# EAGLE design Power-PCB (EAGLE 7.7.0)
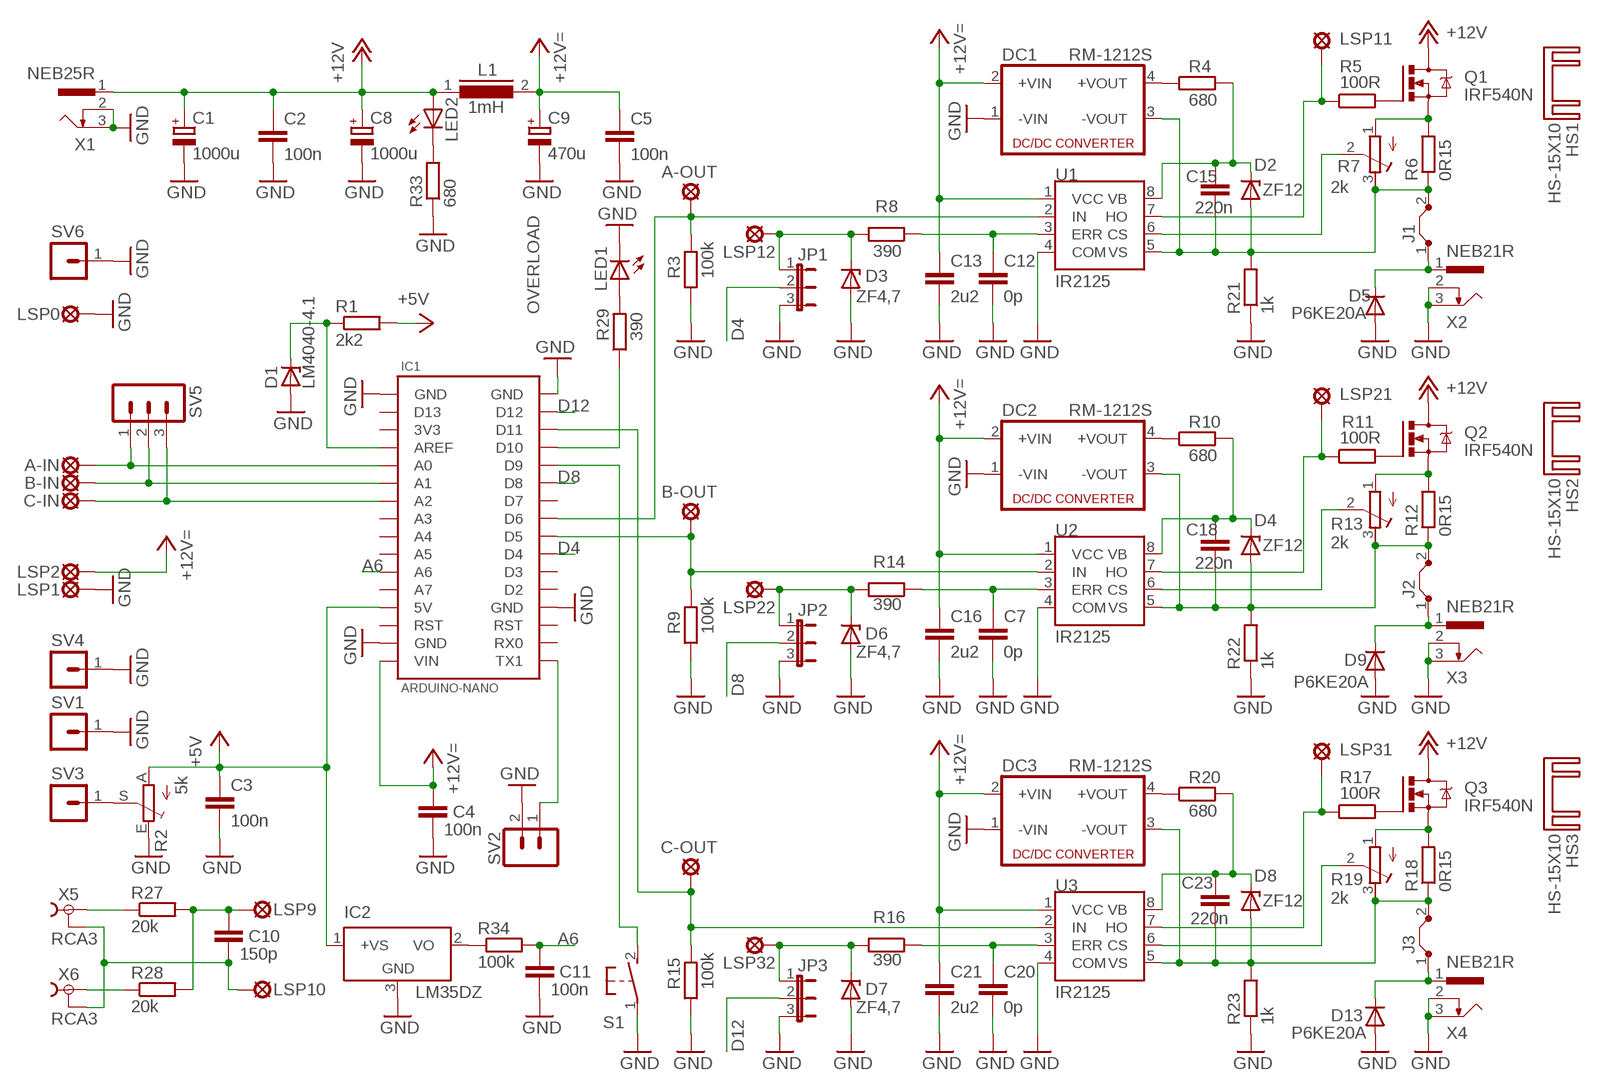
[diagram p0: schematic, sheet 1]

## Parts
A-IN  LSP13  [LSP13]
A-OUT  LSP13  [LSP13]
B-IN  LSP13  [LSP13]
B-OUT  LSP13  [LSP13]
C1  1000u  CPOL-EUE5-13  [E5-13]
C2  100n  C-EU050-024X044  [C050-024X044]
C3  100n  C-EU050-024X044  [C050-024X044]
C4  100n  C-EU050-024X044  [C050-024X044]
C5  100n  C-EU050-024X044  [C050-024X044]
C7  0p  C-EU025-024X044  [C025-024X044]
C8  1000u  CPOL-EUE5-13  [E5-13]
C9  470u  CPOL-EUE5-10.5  [E5-10,5]
C10  150p  C-EU025-024X044  [C025-024X044]
C11  100n  C-EU050-024X044  [C050-024X044]
C12  0p  C-EU025-024X044  [C025-024X044]
C13  2u2  C-EUC1206  [C1206]
C15  220n  C-EU050-024X044  [C050-024X044]
C16  2u2  C-EUC1206  [C1206]
C18  220n  C-EU050-024X044  [C050-024X044]
C20  0p  C-EU025-024X044  [C025-024X044]
C21  2u2  C-EUC1206  [C1206]
C23  220n  C-EU050-024X044  [C050-024X044]
C-IN  LSP13  [LSP13]
C-OUT  LSP13  [LSP13]
D1  LM4040-4.1  LM4040  [TO-92]
D2  ZF12  BZX90  [DO34Z7]
D3  ZF4,7  BZX90  [DO34Z7]
D4  ZF12  BZX90  [DO34Z7]
D5  P6KE20A  DIODE-C1702-05  [C1702-05]
D6  ZF4,7  BZX90  [DO34Z7]
D7  ZF4,7  BZX90  [DO34Z7]
D8  ZF12  BZX90  [DO34Z7]
D9  P6KE20A  DIODE-C1702-05  [C1702-05]
D13  P6KE20A  DIODE-C1702-05  [C1702-05]
DC1  RM-1212S  NME  [NME]
DC2  RM-1212S  NME  [NME]
DC3  RM-1212S  NME  [NME]
HS1  HS-15X10  [HEATSINK-TO220-15X10X21]
HS2  HS-15X10  [HEATSINK-TO220-15X10X21]
HS3  HS-15X10  [HEATSINK-TO220-15X10X21]
IC1  ARDUINO-NANO  [ARDUINO-NANO]
IC2  LM35DZ  LM35CZ  [TO92]
J1  JUMPER-BRIGDE12MM  [12-THICK-WIRE]
J2  JUMPER-BRIGDE12MM  [12-THICK-WIRE]
J3  JUMPER-BRIGDE12MM  [12-THICK-WIRE]
JP1  JP2E  [JP2]
JP2  JP2E  [JP2]
JP3  JP2E  [JP2]
L1  1mH  L-09HCP  [L-09HCP]
LED1  LED5MM  [LED5MM]
LED2  LED3MM  [LED3MM]
LSP0  LSP13  [LSP13]
LSP1  LSP13  [LSP13]
LSP2  LSP13  [LSP13]
LSP9  LSP13  [LSP13]
LSP10  LSP13  [LSP13]
LSP11  LSP11  [LSP11]
LSP12  LSP11  [LSP11]
LSP21  LSP11  [LSP11]
LSP22  LSP11  [LSP11]
LSP31  LSP11  [LSP11]
LSP32  LSP11  [LSP11]
Q1  IRF540N  IRF540  [TO220BV]
Q2  IRF540N  IRF540  [TO220BV]
Q3  IRF540N  IRF540  [TO220BV]
R1  2k2  R-EU_M1206  [M1206]
R2  5k  TRIM_EU-PT10  [PT-10]
R3  100k  R-EU_0207/10  [0207/10]
R4  680  R-EU_0207/10  [0207/10]
R5  100R  R-EU_M1206  [M1206]
R6  0R15  R-EU_0617/5V  [0617V]
R7  2k  R-TRIMM64W  [RTRIM64W]
R8  390  R-EU_M1206  [M1206]
R9  100k  R-EU_0207/10  [0207/10]
R10  680  R-EU_0207/10  [0207/10]
R11  100R  R-EU_M1206  [M1206]
R12  0R15  R-EU_0617/5V  [0617V]
R13  2k  R-TRIMM64W  [RTRIM64W]
R14  390  R-EU_M1206  [M1206]
R15  100k  R-EU_0207/10  [0207/10]
R16  390  R-EU_M1206  [M1206]
R17  100R  R-EU_M1206  [M1206]
R18  0R15  R-EU_0617/5V  [0617V]
R19  2k  R-TRIMM64W  [RTRIM64W]
R20  680  R-EU_0207/10  [0207/10]
R21  1k  R-EU_0207/2V  [0207/2V]
R22  1k  R-EU_0207/2V  [0207/2V]
R23  1k  R-EU_0207/2V  [0207/2V]
R27  20k  R-EU_M1206  [M1206]
R28  20k  R-EU_M1206  [M1206]
R29  390  R-EU_0207/10  [0207/10]
R33  680  R-EU_M1206  [M1206]
R34  100k  R-EU_M1206  [M1206]
S1  31-XX  [B3F-31XX]
SV1  MA01-1  [MA01-1]
SV2  MA02-1  [MA02-1]
SV3  MA01-1  [MA01-1]
SV4  MA01-1  [MA01-1]
SV5  MA03-1  [MA03-1]
SV6  MA01-1  [MA01-1]
U1  IR2125  [DIL08]
U2  IR2125  [DIL08]
U3  IR2125  [DIL08]
X1  NEB25R  NEB21R  [NEB21R]
X2  NEB21R  [NEB21R]
X3  NEB21R  [NEB21R]
X4  NEB21R  [NEB21R]
X5  RCA3  [RCA3]
X6  RCA3  [RCA3]

## Nets
+5V: C3.1 IC1.+5V(5V) IC2.1(+VS) R1.2 R2.A
+12V [Stromversorgung]: C1.+ C2.1 C8.+ L1.1 LED2.A Q1.D Q2.D Q3.D X1.1
+12V= [Stromversorgung]: C4.1 C5.1 C9.+ C13.1 C16.1 C21.1 DC1.2(+VIN) DC2.2(+VIN) DC3.2(+VIN) IC1.VIN L1.2 LSP2.MP U1.1(VCC) U2.1(VCC) U3.1(VCC)
A6: C11.1 IC1.A6 R34.2
AREF: D1.2(C) IC1.AREF R1.1
D4: IC1.D4 JP1.2
D5: B-OUT.MP IC1.D5 R9.2 U2.2(IN)
D6: A-OUT.MP IC1.D6 R3.2 U1.2(IN)
D8: IC1.D8 JP2.2
D11: C-OUT.MP IC1.D11 R15.2 U3.2(IN)
D12: IC1.D12 JP3.2
GND [Stromversorgung]: C1.- C2.2 C3.2 C4.2 C5.2 C7.2 C8.- C9.- C11.2 C12.2 C13.2 C16.2 C20.2 C21.2 D1.3(A) D3.A D5.A D6.A D7.A D9.A D13.A DC1.1(-VIN) DC2.1(-VIN) DC3.1(-VIN) IC1.GND IC1.GND1(GND) IC1.GND2(GND) IC1.GND3(GND) IC2.3(GND) JP1.3 JP2.3 JP3.3 LED1.K(C) LSP0.MP LSP1.MP R2.E R3.1 R9.1 R15.1 R21.1 R22.1 R23.1 R33.1 S1.1(P) SV1.1 SV2.2 SV4.1 SV6.1 U1.4(COM) U2.4(COM) U3.4(COM) X1.2 X1.3 X2.2 X2.3 X3.2 X3.3 X4.2 X4.3
N$1: LED1.A R29.2
N$2: A-IN.MP IC1.A0 SV5.1
N$3: B-IN.MP IC1.A1 SV5.2
N$4: C-IN.MP IC1.A2 SV5.3
N$5: C12.1 R8.1 U1.3(ERR)
N$6: IC1.TX1 SV2.1
N$7: IC2.2(VO) R34.1
N$8: DC1.4(+VOUT) R4.1
N$9: D5.C J1.1 X2.1
N$10: C7.1 R14.1 U2.3(ERR)
N$11: DC2.4(+VOUT) R10.1
N$12: R7.2(S) U1.6(CS)
N$13: C20.1 R16.1 U3.3(ERR)
N$14: LED2.K(C) R33.2
N$15: DC3.4(+VOUT) R20.1
N$16: Q1.G R5.2
N$17: Q1.S R6.2 R7.1(A)
N$18: Q2.S R12.2 R13.1(A)
N$19: Q3.S R18.2 R19.1(A)
N$20: LSP11.MP R5.1 U1.7(HO)
N$21: D6.C JP2.1 LSP22.MP R14.2
N$22: Q2.G R11.2
N$23: LSP21.MP R11.1 U2.7(HO)
N$24: R13.2(S) U2.6(CS)
N$25: D9.C J2.1 X3.1
N$26: R2.S SV3.1
N$27: Q3.G R17.2
N$28: LSP31.MP R17.1 U3.7(HO)
N$29: R19.2(S) U3.6(CS)
N$30: D13.C J3.1 X4.1
N$31: D3.C JP1.1 LSP12.MP R8.2
N$32: D7.C JP3.1 LSP32.MP R16.2
N$35: R27.1 X5.1
N$36: R28.1 X6.1
N$37 [Stromversorgung]: C10.2 LSP10.MP X5.2 X5.2@1 X5.2@2 X6.2 X6.2@1 X6.2@2
N$38 [Stromversorgung]: C10.1 LSP9.MP R27.2 R28.2
N$39: IC1.D9 S1.2(S)
OVERLOAD: IC1.D10 R29.1
VBU1: C15.1 D2.C R4.2 U1.8(VB)
VBU2: C18.1 D4.C R10.2 U2.8(VB)
VBU3: C23.1 D8.C R20.2 U3.8(VB)
VSU1: C15.2 D2.A DC1.3(-VOUT) J1.2 R6.1 R7.3(E) R21.2 U1.5(VS)
VSU2: C18.2 D4.A DC2.3(-VOUT) J2.2 R12.1 R13.3(E) R22.2 U2.5(VS)
VSU3: C23.2 D8.A DC3.3(-VOUT) J3.2 R18.1 R19.3(E) R23.2 U3.5(VS)
Unconnected: IC1.A3 IC1.A4 IC1.A5 IC1.A7 IC1.D2 IC1.D3 IC1.D7 IC1.D13 IC1.RESET1(RST) IC1.RESET(RST) IC1.RX0

## Power pins joined to a net without a drawn wire
3V3: IC1.3V3

## Library data of the parts
A-IN A-OUT B-IN B-OUT C-IN C-OUT LSP0 LSP1 LSP2 LSP9 LSP10 = solpad:LSP13: SOLDER PAD drill 1.3 mm, distributor Buerklin, 12H562
C1 C8 C9 = rcl:CPOL-EU: POLARIZED CAPACITOR, European symbol
C2-C5 C7 C10-C13 C15 C16 C18 C20 C21 C23 = rcl:C-EU: CAPACITOR, European symbol
D1 = tj-library:LM4040: Voltage Reference
D2-D4 D6-D8 = diode:BZX90: Z DIODE
D5 D9 D13 = diode:DIODE-: DIODE
DC1-DC3 = dc-dc-converter:NME: DC-DC CONVERTER; MF: C & D TECHNOLOGIES, INC; MPN: NME1205D; OC_FARNELL: 1021466; OC_NEWARK: 98B8198
HS1-HS3 = tj-library:HS-15X10: Heat Sink TO-220 (China, B:15mm x T:10mm x H:21mm)
IC1 = tj-library:ARDUINO-NANO: Arduino Nano
IC2 = lm35:LM35: Single-Supply Centigrade Temperature Sensor Vout = (10mV/°C x Temp °C) +5mmmV Source: http://www.national.com/ds/LM/LM35.pdf
J1-J3 = tj-library:JUMPER-BRIGDE: Bridge for thick wire (up to 1.35mm)
JP1-JP3 = jumper:JP2E: JUMPER
L1 = tj-library:L-09HCP: Fastron Inductor Series 09HCP
LED1 LED2 = led:LED: LED OSRAM: - CHIPLED LG R971, LG N971, LY N971, LG Q971, LY Q971, LO R971, LY R971 LH N974, LH R974 LS Q976, LO Q976, LY Q976 LO Q996 - Hyper CHIPLED LW Q18S LB Q993, LB Q99A, LB R99A - SideLED LS A670, LO A670, LY A670, LG A670, LP A670 LB A673, LV A673, LT A673, LW A673 LH A674 LY A675 LS A676, LA A676, LO A676, LY A676, LW A676 LS A679, LY A679, LG A679 - Hyper Micro SIDELED® LS Y876, LA Y876, LO Y876, LY Y876 LT Y87S - SmartLED LW L88C, LW L88S LB L89C, LB L89S, LG L890 LS L89K, LO L89K, LY L89K LS L896, LA L896, LO L896, LY L896 - TOPLED LS T670, LO T670, LY T670, LG T670, LP T670 LSG T670, LSP T670, LSY T670, LOP T670, LYG T670 LG T671, LOG T671, LSG T671 LB T673, LV T673, LT T673, LW T673 LH T674 LS T676, LA T676, LO T676, LY T676, LB T676, LH T676, LSB T676, LW T676 LB T67C, LV T67C, LT T67C, LS T67K, LO T67K, LY T67K, LW E67C LS E67B, LA E67B, LO E67B, LY E67B, LB E67C, LV E67C, LT E67C LW T67C LS T679, LY T679, LG T679 LS T770, LO T770, LY T770, LG T770, LP T770 LB T773, LV T773, LT T773, LW T773 LH T774 LS E675, LA E675, LY E675, LS T675 LS T776, LA T776, LO T776, LY T776, LB T776 LHGB T686 LT T68C, LB T68C - Hyper Mini TOPLED® LB M676 - Mini TOPLED Santana® LG M470 LS M47K, LO M47K, LY M47K Source: http://www.osram.convergy.de LUXEON: - LUMILED® LXK2-PW12-R00, LXK2-PW12-S00, LXK2-PW14-U00, LXK2-PW14-V00 LXK2-PM12-R00, LXK2-PM12-S00, LXK2-PM14-U00 LXK2-PE12-Q00, LXK2-PE12-R00, LXK2-PE12-S00, LXK2-PE14-T00, LXK2-PE14-U00 LXK2-PB12-K00, LXK2-PB12-L00, LXK2-PB12-M00, LXK2-PB14-N00, LXK2-PB14-P00, LXK2-PB14-Q00 LXK2-PR12-L00, LXK2-PR12-M00, LXK2-PR14-Q00, LXK2-PR14-R00 LXK2-PD12-Q00, LXK2-PD12-R00, LXK2-PD12-S00 LXK2-PH12-R00, LXK2-PH12-S00 LXK2-PL12-P00, LXK2-PL12-Q00, LXK2-PL12-R00 Source: www.luxeon.com KINGBRIGHT: KA-3528ASYC Source: www.kingbright.com
LSP11 LSP12 LSP21 LSP22 LSP31 LSP32 = solpad:LSP11: SOLDER PAD drill 1.1 mm
Q1-Q3 = transistor-power:IRF540: HEXFET Power MOSFET
R1 R3-R6 R8-R12 R14-R18 R20-R23 R27-R29 R33 R34 = rcl:R-EU_: RESISTOR, European symbol
R2 = pot:TRIM_EU-: POTENTIOMETER
R7 R13 R19 = rcl:R-TRIMM: Trimm resistor
S1 = switch-omron:31-XX: OMRON SWITCH; MPN: B3F-3100; OC_FARNELL: 959704; OC_NEWARK: 36M3582
SV1 SV3 SV4 SV6 = tj-library:MA01-1: PIN HEADER
SV2 = tj-library:MA02-1: PIN HEADER
SV5 = con-lstb:MA03-1: PIN HEADER; OC_FARNELL: unknown; OC_NEWARK: unknown
U1-U3 = ir21xx:IR2125: Current limiting high side driver
X1-X4 = con-lumberg:NEB21R: Netzgeräte-Einbaukupplung abgewinkelte Ausführung mit Öffner Source: http://www.lumberg.com/Produkte/PDFs/NEB21R.pdf; MPN: NEB 21 R; OC_FARNELL: 1217037; OC_NEWARK: 97K6458
X5 X6 = tj-library:RCA3: Female Cinch CONNECTOR ( RCA Jack )

## Net classes
0 default: width 0.406 mm, clearance 0.356 mm
1 Stromversorgung: width 0.61 mm, clearance 0.61 mm

## Board
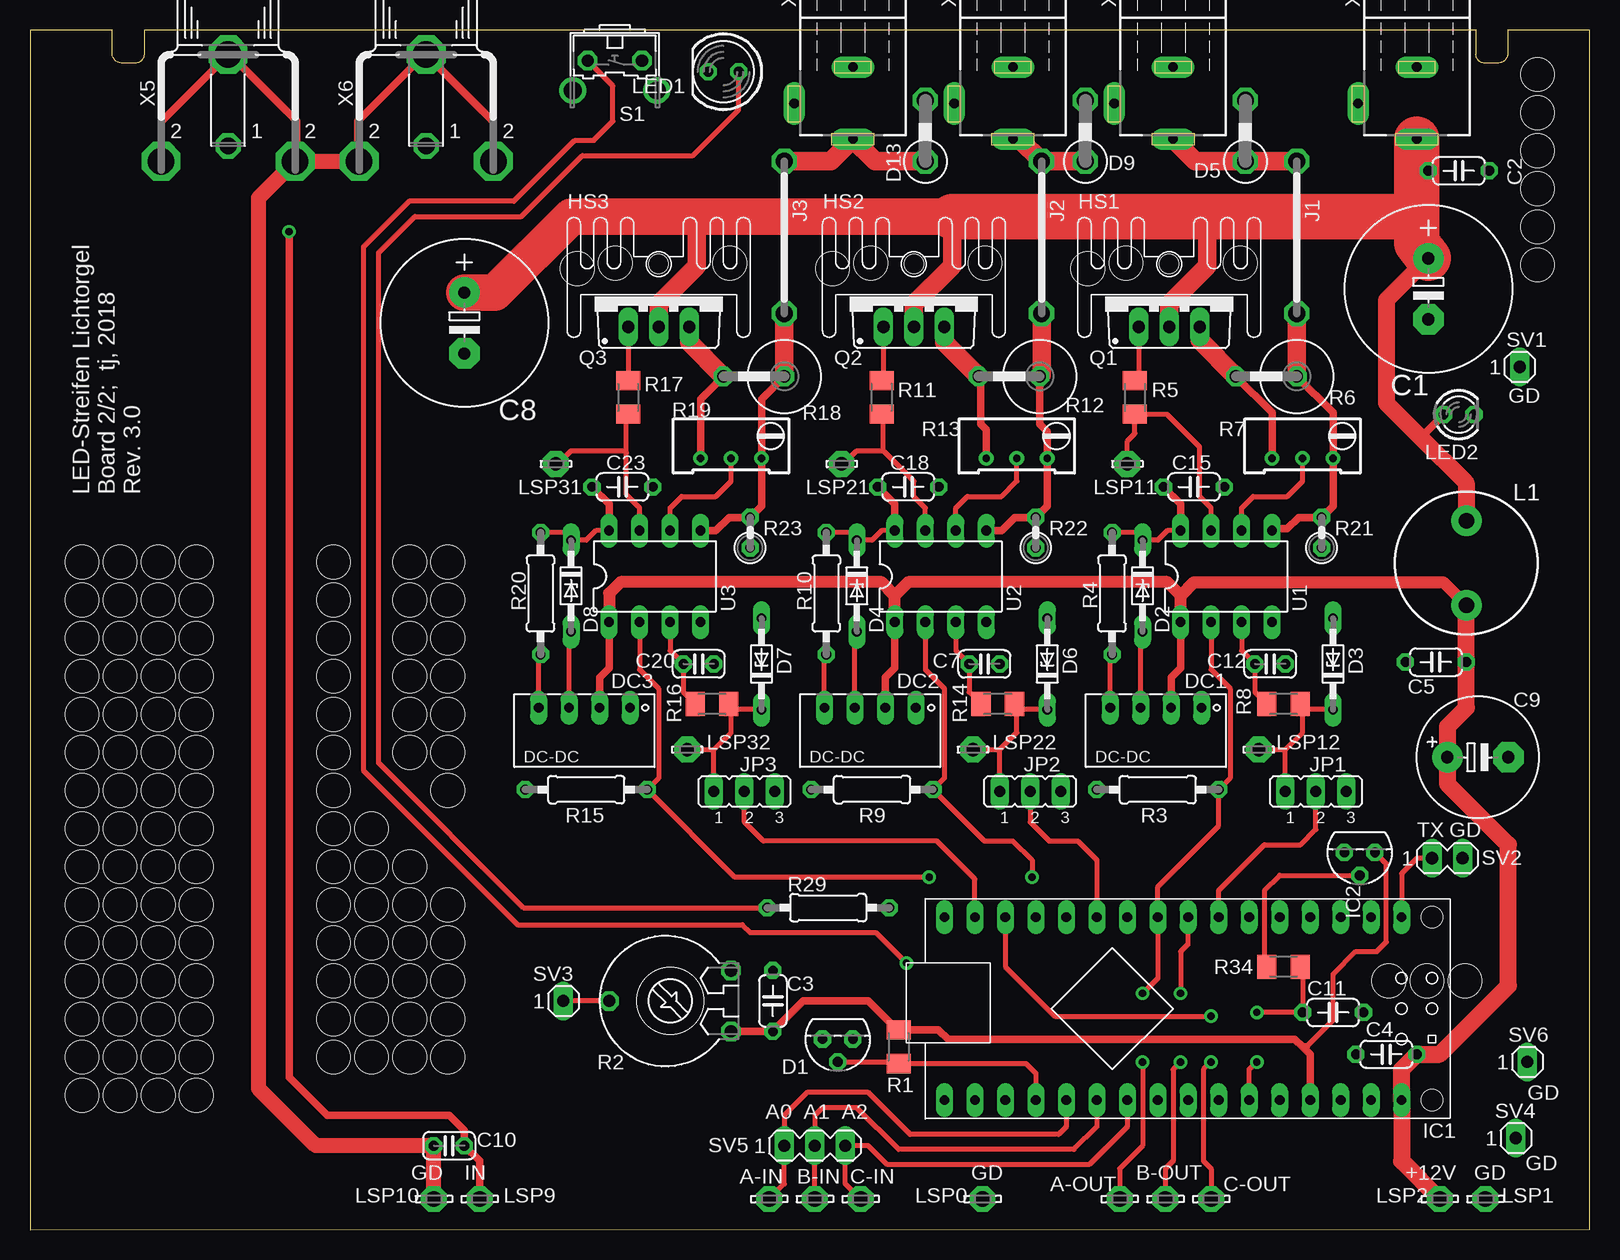
[diagram p1: board, top side]
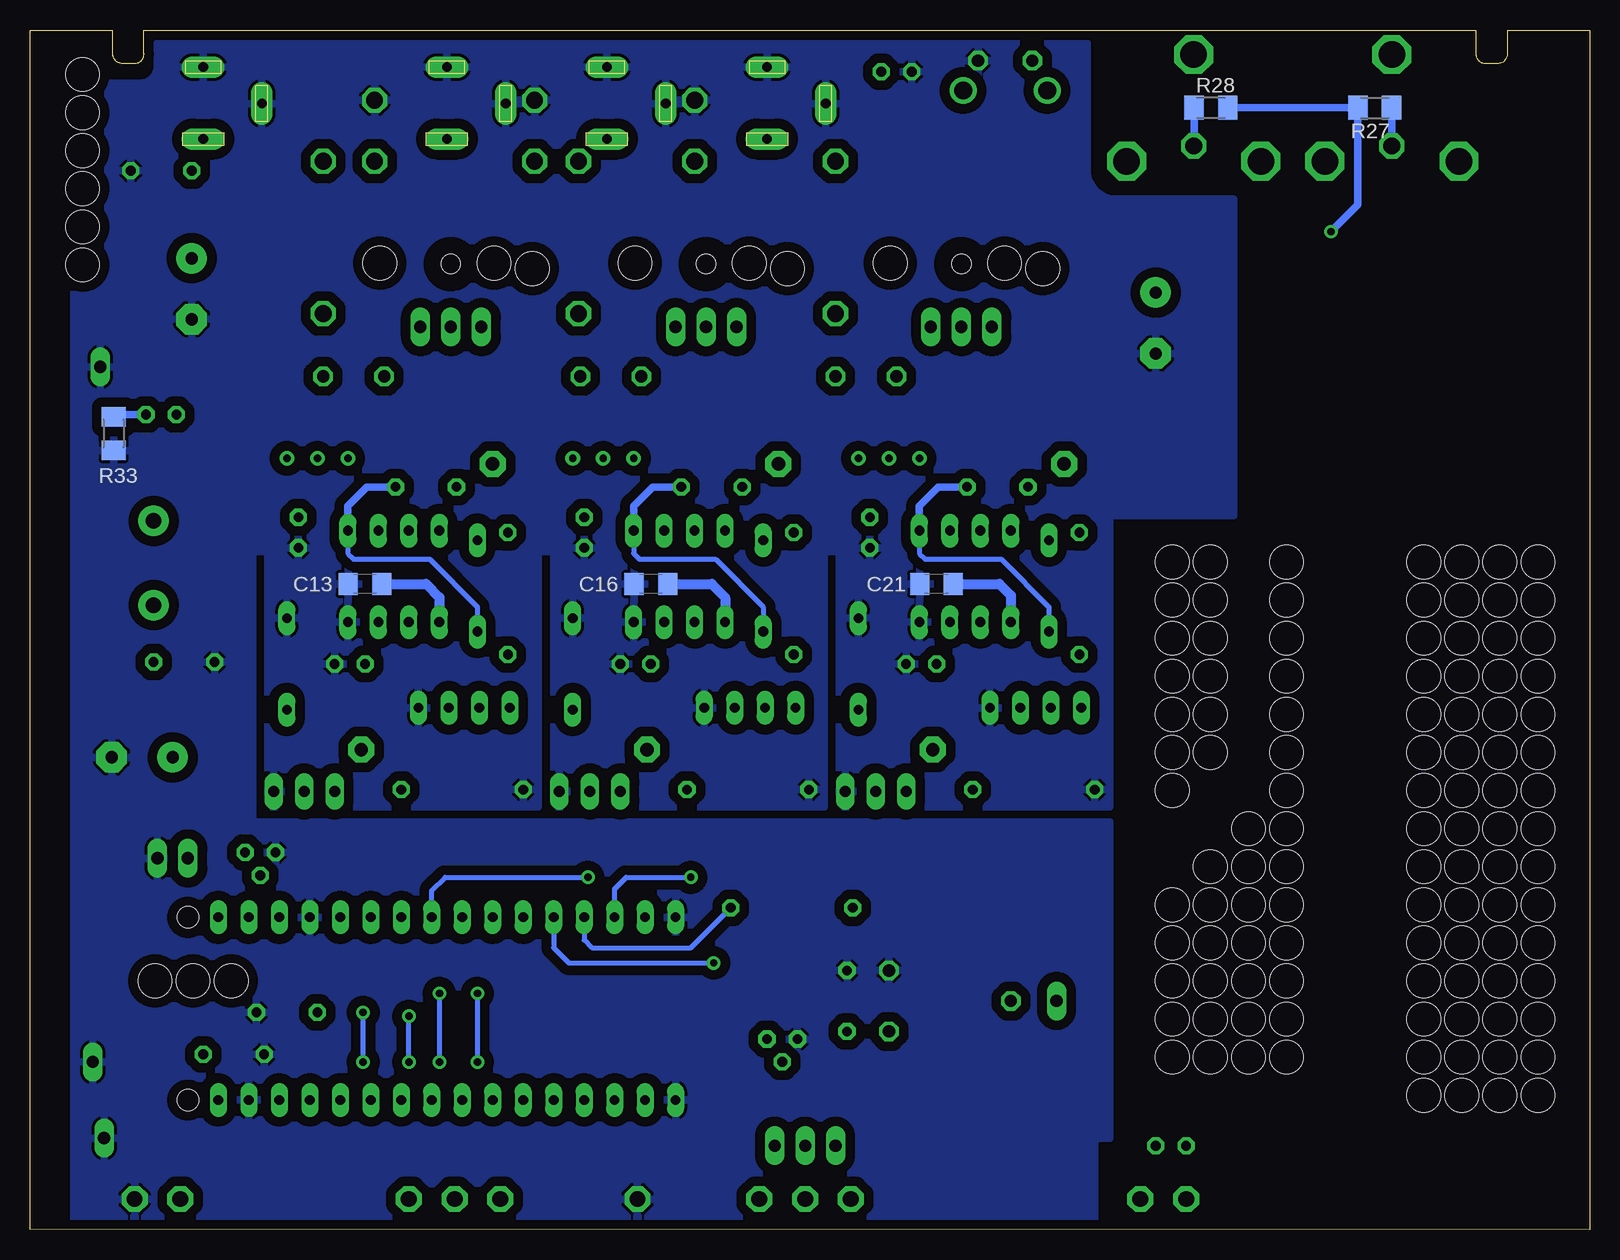
[diagram p2: board, bottom side, seen from below]

Size 130 x 100 mm. Coordinates in mm from the lower left corner, seen from the top.
Outline: 0,0 130,0.03 130,100 123.14,100 123.14,98.13 arc-90 122.4,97.24 121.14,97.24 arc-90 120.5,98.04 120.5,100 9.5,100 9.5,98.04 arc-90 8.86,97.24 7.59,97.24 arc-90 6.84,98.15 6.84,100 0,100 0,0
Copper layers (1*16): Top 0.035mm / dielectric 1.5mm / Bottom 0.035mm
Design rules "default *": minimum track width 10mil, minimum drill 24mil, track to track 8mil, track to pad 8mil, pad to pad 8mil, via to via 8mil, smd to smd 8mil, copper to edge 16mil, drill to drill 8mil, minimum pad ring 12mil, minimum via ring 10mil, stop-mask expansion 4mil, vias tented up to drill 0mil, thermal gap 10mil
Holes 2.8 mm at 58.31,80.57 48.78,80.57 45.61,80.09 66.88,80.09 70.06,80.57 91.33,80.57 79.58,80.57 88.15,80.09 100.85,80.57 34.81,55.65 34.81,52.47 34.81,49.3 34.81,46.12 34.81,42.95 34.81,39.77 34.81,36.6 31.64,55.65 31.64,52.47 31.64,49.3 31.64,46.12 31.64,42.95 31.64,39.77 116.41,20.72 119.58,20.72 34.81,27.07 34.81,23.9 34.81,20.72 34.81,17.55 34.81,14.37 31.64,14.37 31.64,17.55 31.64,20.72 31.64,23.9 31.64,27.07 28.46,14.37 28.46,17.55 28.46,20.72 28.46,23.9 28.46,27.07 28.46,30.25 31.64,30.25 28.46,33.42 7.51,55.65 7.51,52.47 7.51,49.3 7.51,46.12 7.51,42.95 7.51,39.77 7.51,36.6 4.33,55.65 4.33,52.47 4.33,49.3 4.33,46.12 4.33,42.95 4.33,39.77 4.33,36.6 7.51,33.42 7.51,30.25 7.51,27.07 7.51,23.9 7.51,20.72 7.51,17.55 7.51,14.37 4.33,33.42 4.33,30.25 4.33,27.07 4.33,23.9 4.33,20.72 4.33,17.55 4.33,14.37 7.51,11.2 4.33,11.2 10.68,55.65 10.68,52.47 10.68,49.3 10.68,46.12 10.68,42.95 10.68,39.77 10.68,36.6 10.68,33.42 10.68,30.25 10.68,27.07 10.68,23.9 10.68,20.72 10.68,17.55 10.68,14.37 10.68,11.2 25.29,14.37 25.29,17.55 25.29,20.72 25.29,23.9 25.29,27.07 25.29,30.25 25.29,33.42 25.29,36.6 113.23,20.72 125.62,96.29 125.62,93.11 13.86,55.65 13.86,52.47 13.86,49.3 13.86,46.12 13.86,42.95 13.86,39.77 13.86,36.6 13.86,33.42 13.86,30.25 13.86,27.07 13.86,23.9 13.86,20.72 13.86,17.55 13.86,14.37 13.86,11.2 25.29,55.65 25.29,52.47 25.29,49.3 25.29,46.12 25.29,42.95 25.29,39.77 125.62,89.94 125.62,86.76 125.62,83.59 125.62,80.41

### Footprints (pad centres in the part's own frame; a part is rotated, then mirrored left to right if it is on the bottom)
LSP13 = drill 1.321 pad 2.159 octagon: MP 0,0
E5-13 = drill 1.016 pad 2.54: + -2.54,0 | drill 1.016 pad 2.54 octagon: - 2.54,0
C050-024X044 = drill 0.813 octagon: 1 -2.54,0; 2 2.54,0
C025-024X044 = drill 0.813 octagon: 1 -1.27,0; 2 1.27,0
E5-10,5 = drill 1.016 pad 2.54: + -2.54,0 | drill 1.016 pad 2.54 octagon: - 2.54,0
C1206 = smd 1.6 x 1.8: 1 -1.4,0; 2 1.4,0
TO-92 = drill 0.813 octagon: 1 -1.27,0; 2 0,1.905; 3 1.27,0
DO34Z7 = drill 0.813 long: A 3.81,0; C -3.81,0
C1702-05 = drill 1.397 octagon: A 2.54,0; C -2.54,0
NME = drill 0.813 long: 1 0,3.81; 2 0,1.27; 3 0,-1.27; 4 0,-3.81
HEATSINK-TO220-15X10X21 = hole 1.6: 0,1.111
ARDUINO-NANO = drill 0.813 long: 3V3 -15.24,-7.62; +5V 10.16,-7.62; A0 -10.16,-7.62; A1 -7.62,-7.62; A2 -5.08,-7.62; A3 -2.54,-7.62; A4 0,-7.62; A5 2.54,-7.62; A6 5.08,-7.62; A7 7.62,-7.62; AREF -12.7,-7.62; D2 7.62,7.62; D3 5.08,7.62; D4 2.54,7.62; D5 0,7.62; D6 -2.54,7.62; D7 -5.08,7.62; D8 -7.62,7.62; D9 -10.16,7.62; D10 -12.7,7.62; D11 -15.24,7.62; D12 -17.78,7.62; D13 -17.78,-7.62; GND 10.16,7.62; GND1 15.24,-7.62; GND2 -20.32,7.62; GND3 -20.32,-7.62; RESET 12.7,7.62; RESET1 12.7,-7.62; RX0 15.24,7.62; TX1 17.78,7.62; VIN 17.78,-7.62 | hole 1.778: 20.32,7.62; 20.32,-7.62
TO92 = drill 0.813 octagon: 1 -1.27,0; 2 0,1.905; 3 1.27,0
12-THICK-WIRE = drill 1.4 octagon: 1 -6.35,0; 2 6.35,0
JP2 = drill 0.914 long: 1 -2.54,0; 2 0,0; 3 2.54,0
L-09HCP = drill 1.3 pad 2.54: 1 -3.516,0; 2 3.516,0
LED5MM = drill 0.813 octagon: A -1.27,0; K 1.27,0
LED3MM = drill 0.813 octagon: A -1.27,0; K 1.27,0
LSP11 = drill 1.118 pad 2.159 octagon: MP 0,0
TO220BV = drill 1.016 long: D 0,-2.54; G -2.54,-2.54; S 2.54,-2.54
M1206 = smd 1.6 x 2: 1 -1.4,0; 2 1.4,0
PT-10 = drill 1.016 octagon: A -2.54,-5.08; E 2.54,-5.08; S 0,5.08
0207/10 = drill 0.813 octagon: 1 -5.08,0; 2 5.08,0
0617V = drill 1.016 octagon: 1 -2.54,0; 2 2.54,0
RTRIM64W = drill 0.61: 1 1.27,-2.54; 2 1.27,0; 3 1.27,2.54
0207/2V = drill 0.813 octagon: 1 -1.27,0; 2 1.27,0
B3F-31XX = drill 1.016 octagon: 1 -2.261,-1.245; 2 2.261,-1.245 | drill 1.499 pad 2.159: 3 -3.505,1.245; 4 3.505,1.245
MA01-1 = drill 1.016 long: 1 0,0
MA02-1 = drill 1.016 long: 1 -1.27,0; 2 1.27,0
MA03-1 = drill 1.016 long: 1 -2.54,0; 2 0,0; 3 2.54,0
DIL08 = drill 0.813 long: 1 -3.81,-3.81; 2 -1.27,-3.81; 3 1.27,-3.81; 4 3.81,-3.81; 5 3.81,3.81; 6 1.27,3.81; 7 -1.27,3.81; 8 -3.81,3.81
NEB21R = drill 0.813 pad 1.778 long: 1 0,7.35; 2 4.9,4.4; 3 0,1.35
RCA3 = drill 1.397 octagon: 1 0,-2.54 | drill 2.21 octagon: 2 5.588,-3.81; 2@1 -5.588,-3.81; 2@2 0,5.08

### Placement (x,y rotation side)
A-IN  61.59,2.54 0 top
A-OUT  90.81,2.54 0 top
B-IN  65.41,2.54 0 top
B-OUT  94.61,2.54 0 top
C1  116.52,78.42 270 top
C2  119.06,88.27 0 top
C3  61.91,19.05 90 top
C4  113.03,14.61 180 top
C5  117.16,47.31 180 top
C7  79.53,47.15 0 top
C8  36.2,75.56 270 top
C9  120.65,39.37 0 top
C10  34.92,6.99 180 top
C11  108.58,18.1 0 top
C12  103.35,47.15 0 top
C13  102.08,53.82 180 bottom
C15  97,61.91 0 top
C16  78.26,53.82 180 bottom
C18  73.18,61.91 0 top
C20  55.72,47.15 0 top
C21  54.45,53.82 180 bottom
C23  49.37,61.91 0 top
C-IN  69.22,2.54 0 top
C-OUT  98.42,2.54 0 top
D1  67.31,15.88 180 top
D2  92.71,53.66 270 top
D3  108.58,47.15 90 top
D4  68.9,53.66 270 top
D5  101.28,91.6 90 top
D6  84.77,47.15 90 top
D7  60.96,47.15 90 top
D8  45.09,53.66 270 top
D9  87.95,91.6 90 top
D13  74.61,91.6 90 top
DC1  93.82,43.5 270 top
DC2  70.01,43.5 270 top
DC3  46.2,43.5 270 top
HS1  94.93,79.38 0 top
HS2  73.66,79.38 0 top
HS3  52.39,79.38 0 top
IC1  96.52,18.41 0 top
IC2  110.81,31.43 180 top
J1  105.57,82.71 270 top
J2  84.3,82.71 270 top
J3  62.87,82.71 270 top
JP1  107.16,36.51 0 top
JP2  83.34,36.51 0 top
JP3  59.53,36.51 0 top
L1  119.7,55.56 270 top
LED1  57.78,96.52 180 top
LED2  119.06,67.94 0 top
LSP0  79.38,2.54 0 top
LSP1  121.28,2.54 0 top
LSP2  117.47,2.54 0 top
LSP9  37.47,2.54 0 top
LSP10  33.66,2.54 0 top
LSP11  91.44,63.82 0 top
LSP12  102.39,40.01 0 top
LSP21  67.63,63.82 0 top
LSP22  78.58,40.01 0 top
LSP31  43.81,63.82 0 top
LSP32  54.77,40.01 0 top
Q1  94.93,77.79 0 top
Q2  73.66,77.79 0 top
Q3  52.39,77.79 0 top
R1  72.39,15.24 90 top
R2  53.34,19.05 90 top
R3  93.98,36.67 0 top
R4  90.17,53.02 90 top
R5  92.08,69.37 90 top
R6  103.03,71.12 180 top
R7  106.05,65.56 270 top
R8  104.46,43.81 0 top
R9  70.17,36.67 0 top
R10  66.36,53.02 90 top
R11  70.96,69.37 90 top
R12  81.6,71.12 180 top
R13  82.23,65.56 270 top
R14  80.64,43.81 0 top
R15  46.35,36.67 0 top
R16  56.83,43.81 0 top
R17  49.85,69.37 90 top
R18  60.33,71.12 180 top
R19  58.42,65.56 270 top
R20  42.55,53.02 90 top
R21  107.63,58.1 90 top
R22  83.82,58.1 90 top
R23  60.01,58.1 90 top
R27  17.94,93.5 180 bottom
R28  31.59,93.5 0 bottom
R29  66.52,26.83 180 top
R33  123.03,66.36 90 bottom
R34  104.46,21.91 0 top
S1  48.74,96.2 180 top
SV1  124.14,71.91 0 top
SV2  118.11,30.96 0 top
SV3  44.45,19.05 0 top
SV4  123.83,7.62 0 top
SV5  65.41,6.99 0 top
SV6  124.78,13.97 0 top
U1  99.69,54.45 0 top
U2  75.88,54.45 0 top
U3  52.07,54.45 0 top
X1  115.57,98.27 180 top
X2  95.25,98.27 180 top
X3  81.92,98.27 180 top
X4  68.58,98.27 180 top
X5  16.51,92.87 0 top
X6  33.02,92.87 0 top

### Tracks (layer width: path | path; a pad name or v marks a point on that pad's centre or on a via)
+5V
  Top 0.406: 106.36,15.24 108.58,17.46 108.58,21.27 110.49,23.18 112.24,23.18 113.03,23.97 113.03,30.48 IC2.1
  Top 0.61: R2.A C3.1 64.45,19.05 69.85,19.05 72.23,16.67 R1.2 75.69,16.64 76.52,15.88 105.41,15.88 106.05,15.24 | 106.05,15.24 106.68,14.61 IC1.+5V | 106.05,15.24 106.36,15.24
+12V
  Top 0.61: LED2.A 115.89,66.04
  Top 1.27: C2.1 115.57,88.27
  Top 1.422: C1.+ 113.03,77.47 113.03,68.9 115.89,66.04 119.67,62.25 119.67,59.1 L1.1
  Top 1.524: Q1.D 94.93,77.15 98.11,80.33 98.11,84.45 | Q2.D 73.66,77.15 76.83,80.33 76.83,84.45 | Q3.D 52.39,77.15 55.56,80.33 55.56,84.45
  Top 3.048: 76.83,84.45 55.56,84.45 45.09,84.45 38.73,78.11 C8.+
  Top 3.81: 115.57,84.77 115.57,82.23 C1.+ | 76.83,84.45 98.11,84.45 115.25,84.45 115.57,84.77 | 115.57,84.77 115.57,88.27 X1.1
+12V=
  Top 0.61: U1.1 95.89,46.83 95.09,46.04 DC1.2 | DC2.2 71.28,46.04 72.07,46.83 U2.1 | DC3.2 47.47,46.04 48.26,46.83 U3.1
  Top 1.016: 95.89,52.86 97,53.98 117.77,53.98 L1.2 | U1.1 95.89,52.86 | 95.89,52.86 94.77,53.98 73.18,53.98 72.07,52.86 | U2.1 72.07,52.86 | 72.07,52.86 70.96,53.98 49.21,53.98 48.26,53.02 U3.1
  Top 1.422: LSP2.MP 114.3,5.71 IC1.VIN 114.3,13.34 C4.1 117.47,14.61 123.19,20.32 123.19,32.07 118.11,37.15 C9.+ 118.11,41.91 119.7,43.5 C5.1 L1.2
  Bottom 0.813: C13.1 97,53.82 95.89,52.7 U1.1 | C16.1 73.18,53.82 72.07,52.7 U2.1 | C21.1 49.21,53.82 48.26,52.86 U3.1
A6  (via drill 0.61)
  Top 0.406: IC1.A6 101.6,13.34 v102.23,13.97 | R34.2 105.86,21.78 106.05,21.59 C11.1 v102.23,18.1
  Bottom 0.406: v102.23,13.97 v102.23,18.1
AREF
  Top 0.406: D1.2 72.26,13.97 R1.1 83,13.84 83.82,13.02 IC1.AREF
D4
  Top 0.406: IC1.D4 99.06,28.26 102.87,32.07 105.89,32.07 107.16,33.34 JP1.2
D5  (via drill 0.61)
  Top 0.406: v95.89,19.68 95.89,23.18 96.52,23.81 IC1.D5 | v95.89,13.97 95.25,13.34 95.25,5.71 94.61,5.08 B-OUT.MP | U2.2 74.61,46.67 76.2,45.09 76.2,37.62 R9.2 79.53,32.38 81.92,32.38 83.5,30.8 v83.5,29.37
  Bottom 0.406: v95.89,19.68 v95.89,13.97 | IC1.D5 96.52,28.26 95.41,29.37 v83.5,29.37
D6  (via drill 0.61)
  Top 0.406: v92.71,19.68 93.98,20.95 IC1.D6 93.98,28.57 99.06,33.66 R3.2 100.01,37.62 100.01,45.09 98.42,46.67 U1.2 | v92.71,13.97 92.71,6.99 90.81,5.08 A-OUT.MP
  Bottom 0.406: v92.71,19.68 v92.71,13.97
D8
  Top 0.406: JP2.2 83.34,33.97 84.93,32.38 87.31,32.38 88.9,30.8 IC1.D8
D11  (via drill 0.61)
  Top 0.406: v98.42,13.97 97.79,13.34 97.79,5.71 98.42,5.08 C-OUT.MP | IC1.D11 81.28,21.91 85.41,17.78 v98.42,17.78 | U3.2 50.8,46.67 52.39,45.09 52.39,37.62 R15.2 58.74,29.37 v74.93,29.37
  Bottom 0.406: v98.42,13.97 v98.42,17.78 | IC1.D11 81.28,28.42 80.33,29.37 v74.93,29.37
D12
  Top 0.406: IC1.D12 78.74,29.21 75.56,32.38 61.12,32.38 59.53,33.97 JP3.2
GND
  pour Bottom (isolate 0.813): 41.91,98.9 119.38,98.9 119.38,96.99 arc90 120.8,95.57 126.36,95.57 126.36,0.64 41.27,0.64 41.27,7.62 40.01,7.62 40.01,33.97 111.44,33.97 111.44,56.52 110.17,56.52 110.17,35.24 87.63,35.24 87.63,56.52 86.36,56.52 86.36,35.24 63.82,35.24 63.82,56.52 62.55,56.52 62.55,35.24 40.01,35.24 40.01,59.53 29.69,59.53 29.69,85.88 39.35,85.88 arc90 41.91,88.29
N$1
  Top 0.406: LED1.A 59.05,93.34 55.24,89.53 46.04,89.53 40.96,84.45 32.07,84.45 29.05,81.44 29.05,38.89 41.12,26.83 R29.2
N$2
  Top 0.406: A-IN.MP 62.87,3.81 SV5.1 62.87,9.53 64.77,11.43 69.85,11.43 73.34,7.94 85.72,7.94 86.36,8.57 IC1.A0
N$3
  Top 0.406: B-IN.MP SV5.2 65.41,9.53 66.04,10.16 68.9,10.16 72.39,6.67 87,6.67 88.9,8.57 IC1.A1
N$4
  Top 0.406: C-IN.MP 67.94,3.81 SV5.3 69.85,6.99 71.44,5.4 88.27,5.4 91.44,8.57 IC1.A2
N$5
  Top 0.406: U1.3 100.97,48.26 C12.1 102.08,44.8 R8.1
N$6
  Top 0.406: SV2.1 115.57,30.96 114.3,29.69 IC1.TX1
N$7
  Top 0.406: R34.1 102.87,22.09 102.87,28.26 104.14,29.53 IC2.2
N$8
  Top 0.406: DC1.4 90.01,47.78 R4.1
N$9
  Top 1.524: J1.1 D5.C 97.11,89.06 X2.1
N$10
  Top 0.406: U2.3 77.15,48.26 C7.1 78.26,44.8 R14.1
N$11
  Top 0.406: DC2.4 66.2,47.78 R10.1
N$12
  Top 0.406: U1.6 100.97,60.17 101.92,61.12 104.78,61.12 106.05,62.39 R7.2
N$13
  Top 0.406: U3.3 53.34,48.26 C20.1 54.45,44.8 R16.1
N$14
  Bottom 0.61: LED2.K 123,67.94 R33.2
N$15
  Top 0.406: DC3.4 42.39,47.78 R20.1
N$16
  Top 0.406: Q1.G 92.39,70.93 R5.2
N$17
  Top 0.61: R6.2 103.5,68.1 R7.1
  Top 1.524: R6.2 97.47,74.14 Q1.S
N$18
  Top 0.406: 79.22,70.96 R12.2
  Top 0.61: R13.1 79.69,66.67 79.22,67.15 79.22,70.96
  Top 1.524: Q2.S 76.2,73.98 R12.2
N$19
  Top 0.61: R19.1 55.88,69.22 R18.2
  Top 1.524: Q3.S 54.93,73.98 R18.2
N$20
  Top 0.406: U1.7 98.42,60.17 97.47,61.12 97.47,65.25 94.77,67.94 92.9,67.94 R5.1 92.08,66.36 91.44,65.72 LSP11.MP
N$21
  Top 0.406: D6.C 82.52,43.34 | 82.52,43.34 R14.2 | LSP22.MP 80.8,40.01 | 80.8,40.01 82.23,41.43 82.23,43.05 82.52,43.34 | JP2.1 80.8,40.01
N$22
  Top 0.406: Q2.G 71.12,71.28 70.48,70.64 R11.2
N$23
  Top 0.406: U2.7 74.61,60.17 73.66,61.12 73.66,62.39 71.12,64.93 | 71.12,64.93 71.12,67.81 R11.1 | LSP21.MP 67.79,63.82 68.9,64.93 71.12,64.93
N$24
  Top 0.406: U2.6 77.15,60.17 78.11,61.12 80.96,61.12 82.23,62.39 R13.2
N$25
  Top 1.524: X3.1 82.44,90.92 J2.1 D9.C
N$26
  Top 0.406: R2.S SV3.1
N$27
  Top 0.406: Q3.G 49.85,71.12 49.53,70.8 R17.2
N$28
  Top 0.406: U3.7 50.8,60.17 49.69,61.28 49.69,64.77 | 49.69,64.77 49.69,67.81 R17.1 | LSP31.MP 43.97,63.82 45.09,64.93 49.53,64.93 49.69,64.77
N$29
  Top 0.406: U3.6 53.34,60.17 54.29,61.12 57.15,61.12 58.42,62.39 R19.2
N$30
  Top 1.524: J3.1 66.72,89.06 X4.1 70.44,89.06 D13.C
N$31
  Top 0.406: D3.C 106.33,43.34 | 106.33,43.34 R8.2 | LSP12.MP 104.62,40.01 | 104.62,40.01 106.05,41.43 106.05,43.05 106.33,43.34 | JP1.1 104.62,40.01
N$32
  Top 0.406: D7.C 58.71,43.34 | 58.71,43.34 R16.2 | LSP32.MP 56.99,40.01 | 56.99,40.01 58.42,41.43 58.42,43.05 58.71,43.34 | JP3.1 56.99,40.01
N$35
  Bottom 0.406: X5.1 16.54,90.33
  Bottom 0.61: 16.54,90.33 R27.1
N$36
  Bottom 0.406: X6.1 32.99,90.33
  Bottom 0.61: 32.99,90.33 R28.1
N$37
  Top 0.61: X5.2@1 10.92,92.36 X5.2@2 16.67,97.95 22.23,92.39 22.23,89.19 X5.2 | X6.2 38.61,92.36 X6.2@2 32.86,97.95 27.3,92.39 27.3,89.19 X6.2@1
  Top 1.27: LSP10.MP C10.2 23.81,6.99 19.05,11.75 19.05,86.01 X5.2 X6.2@1
N$38  (via drill 0.61)
  Top 0.61: v21.59,83.19 21.59,12.7 24.77,9.53 34.92,9.53 36.2,8.26 C10.1 37.47,5.71 LSP9.MP
  Bottom 0.61: R28.2 R27.2 19.34,85.44 v21.59,83.19
N$39  (via drill 0.61)
  Top 0.406: S1.2 48.58,95.34 48.58,92.39 46.99,90.81 45.4,90.81 40.32,85.72 31.59,85.72 27.78,81.92 27.78,38.26 40.64,25.4 59.37,25.4 60.01,24.77 70.48,24.77 v73.03,22.23
  Bottom 0.406: IC1.D9 86.36,23.5 85.09,22.23 v73.03,22.23
OVERLOAD
  Bottom 0.406: IC1.D10 83.82,24.13 83.19,23.5 74.93,23.5 R29.1
VBU1
  Top 0.406: U1.8 94.77,58.26 93.98,57.47 D2.C 92.71,57.78 92.39,58.1 R4.2
  Top 0.61: U1.8 95.89,60.48 C15.1
VBU2
  Top 0.406: U2.8 70.96,58.26 70.17,57.47 D4.C 68.9,57.78 68.58,58.1 R10.2
  Top 0.61: C18.1 72.07,60.48 U2.8
VBU3
  Top 0.406: U3.8 47.15,58.26 46.35,57.47 D8.C 45.09,57.78 44.77,58.1 R20.2
  Top 0.61: C23.1 48.26,60.48 U3.8
VSU1
  Top 0.406: 103.66,58.42 U1.5 | DC1.3 92.55,49.69 D2.A
  Top 0.61: R6.1 108.58,68.1 R7.3 108.58,60.33 R21.2 105.73,59.37 104.78,58.42 103.66,58.42
  Top 1.524: J1.2 R6.1
  Bottom 0.406: U1.5 103.5,56.36 103.03,55.88 96.68,55.88 92.71,51.91 D2.A
  Bottom 0.61: C15.2 101.92,61.91 103.5,60.33 U1.5
VSU2
  Top 0.406: DC2.3 68.74,49.69 D4.A
  Top 0.61: U2.5 80.96,58.26 82.07,59.37 R22.2 84.77,60.33 R13.3 84.77,66.52 84.14,67.15 R12.1
  Top 1.422: 84.3,71.28 R12.1
  Top 1.524: J2.2 84.3,71.28
  Bottom 0.406: U2.5 79.69,56.36 79.22,55.88 72.87,55.88 68.9,51.91 D4.A
  Bottom 0.61: C18.2 78.11,61.91 79.69,60.33 U2.5
VSU3
  Top 0.406: DC3.3 44.93,49.69 D8.A
  Top 0.61: R18.1 60.96,69.22 R19.3 60.96,60.33 R23.2 58.26,59.37 57.15,58.26 U3.5
  Top 1.524: J3.2 R18.1
  Bottom 0.406: U3.5 55.88,56.36 55.4,55.88 49.05,55.88 45.09,51.91 D8.A
  Bottom 0.61: C23.2 54.29,61.91 55.88,60.33 U3.5

### Text on the board
tPlace: GD | LED-Streifen Lichtorgel / Board 2/2; tj, 2018 / Rev. 3.0 | TX | GD | GD | A0 | A1 | A2 | GD | GD | IN | GD | +12V | GD